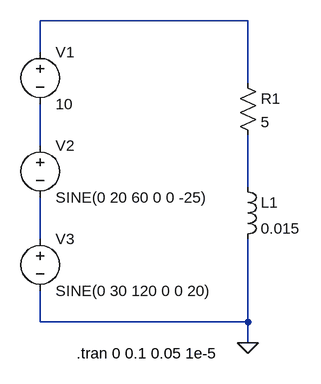
[diagram p0: schematic hw2_1.asc]
hw2_1.asc, the LTspice schematic file:
Version 4
SHEET 1 1288 680
WIRE 576 128 256 128
WIRE 256 176 256 128
WIRE 576 224 576 128
WIRE 256 320 256 256
WIRE 576 384 576 304
WIRE 256 464 256 400
WIRE 256 592 256 544
WIRE 576 592 576 464
WIRE 576 592 256 592
WIRE 576 624 576 592
FLAG 576 624 0
SYMBOL res 560 208 R0
SYMATTR InstName R1
SYMATTR Value 5
SYMBOL ind 560 368 R0
SYMATTR InstName L1
SYMATTR Value 0.015
SYMBOL voltage 256 160 R0
SYMATTR InstName V1
SYMATTR Value 10
SYMBOL voltage 256 304 R0
SYMATTR InstName V2
SYMATTR Value SINE(0 20 60 0 0 -25)
SYMBOL voltage 256 448 R0
SYMATTR InstName V3
SYMATTR Value SINE(0 30 120 0 0 20)
TEXT 312 640 Left 2 !.tran 0 0.1 0.05 1e-5

The netlist it stands for:
* hw2_1.asc
R1 N001 N003 5
L1 N003 0 0.015
V1 N001 N002 10
V2 N002 N004 SINE(0 20 60 0 0 -25)
V3 N004 0 SINE(0 30 120 0 0 20)
.tran 0 0.1 0.05 1e-5
.backanno
.end